# Altium schematic sheet board.SchDoc: LoRa Board (Phoebe)
size A3; Author: Enrico Oliveira Rocheti; CompanyName: Time Energy; Revision: 0; SheetNumber: 1; SheetTotal: 1; ProjectName: LoRa Board (Phoebe)
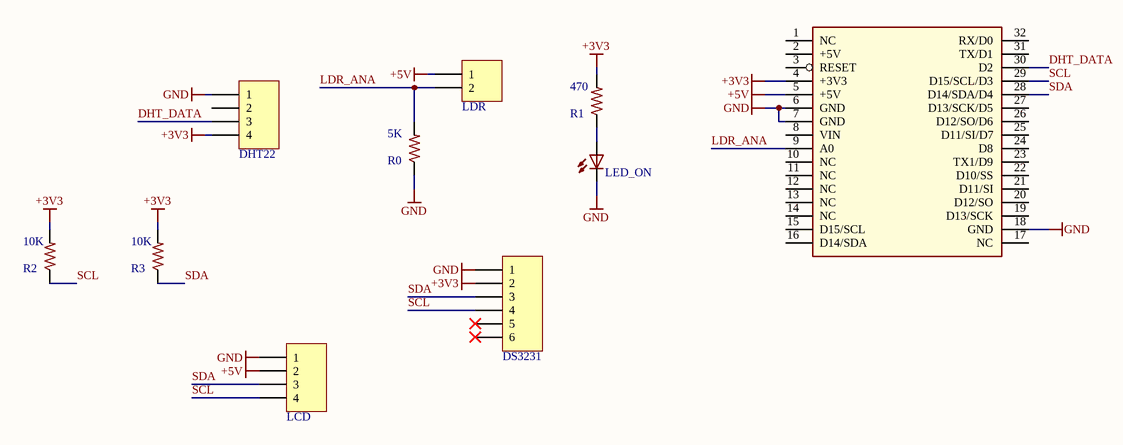
[diagram p0: board.SchDoc]

## Parts
DHT22  04p  [61300411121]  (value not drawn)
DS3231  06p  [61300611121]  (value not drawn)
LCD  04p  [61300411121]  (value not drawn)
LDR  02p  [61300211121]  (value not drawn)
LED_ON  (no value)  [CHIPLED_0805]
R0  value 5K  [R0603]  (hidden comment: R-US_R0603)
R1  value 470  [R0603]  (hidden comment: R-US_R0603)
R2  value 10K  [R0603]  (hidden comment: R-US_R0603)
R3  value 10K  [R0603]  (hidden comment: R-US_R0603)
U0  WEMOS D1  [WEMOS D1]  (value not drawn)

## Nets
+3V3: DHT22.4 DS3231.2 R1.2 R2.2 R3.2 U0.4(+3V3)
+5V: LCD.2 LDR.1 U0.5(+5V)
GND: DHT22.1 DS3231.1 LCD.1 LED_ON.C R0.1 U0.6(GND) U0.7(GND) U0.18(GND)
DHT_DATA: DHT22.3 U0.30(D2)
LDR_ANA: LDR.2 R0.2 U0.9(A0)
SCL: DS3231.4 LCD.4 R2.1 U0.29(D15/SCL/D3)
SDA: DS3231.3 LCD.3 R3.1 U0.28(D14/SDA/D4)
NetLED_ON_A: LED_ON.A R1.1

Not connected (* = marked no-connect by the designer): DHT22 2; DS3231 5* 6*; U0 1(NC) 2(+5V) 3(RESET) 8(VIN) 10(NC) 11(NC) 12(NC) 13(NC) 14(NC) 15(D15/SCL) 16(D14/SDA) 17(NC) 19(D13/SCK) 20(D12/SO) 21(D11/SI) 22(D10/SS) 23(TX1/D9) 24(D8) 25(D11/SI/D7) 26(D12/SO/D6) 27(D13/SCK/D5) 31(TX/D1) 32(RX/D0)

## Notes on the sheet
- Projeto:
- Data:
- Obs:
- Folha:
- Revisão:

## Library data of the parts
DHT22 LCD = 61300411121: WR-PHD 2.54 mm THT Pin Header, 04p; Vendor: Wurth Elektronik; Part Number: 61300411121; Value: 04p
DS3231 = 61300611121: WR-PHD 2.54 mm THT Pin Header, 06p; Vendor: Wurth Elektronik; Part Number: 61300611121; Value: 06p
LDR = 61300211121: WR-PHD 2.54 mm THT Pin Header, 02p; Vendor: Wurth Elektronik; Part Number: 61300211121; Value: 02p
LED_ON = LEDCHIPLED_0805: Part Number: AP2012EC; Vendor: Kingbright; Família: LEDs; Colour: Vermelho
R0-R3 = R-US_R0603: Part Number: RC0603FR-07470RL; Vendor: Yageo; Família: Resistores
U0 = WEMOS D1: Arduino UNO Compatible wifi board based on ESP8266EX; Part Number: WEMOS D1